# Altium schematic sheet 11_PoE_USB_PD.SchDoc: PoE and USB PD (part 1 of 3)
size A3; Organization: Lime Microsystems; Address1: Surrey Tech Centre; Address2: Guildford GU2 7YG; Address3: Surrey; Address4: United Kingdom; Revision: v1.1; SheetNumber: 11; SheetTotal: 12
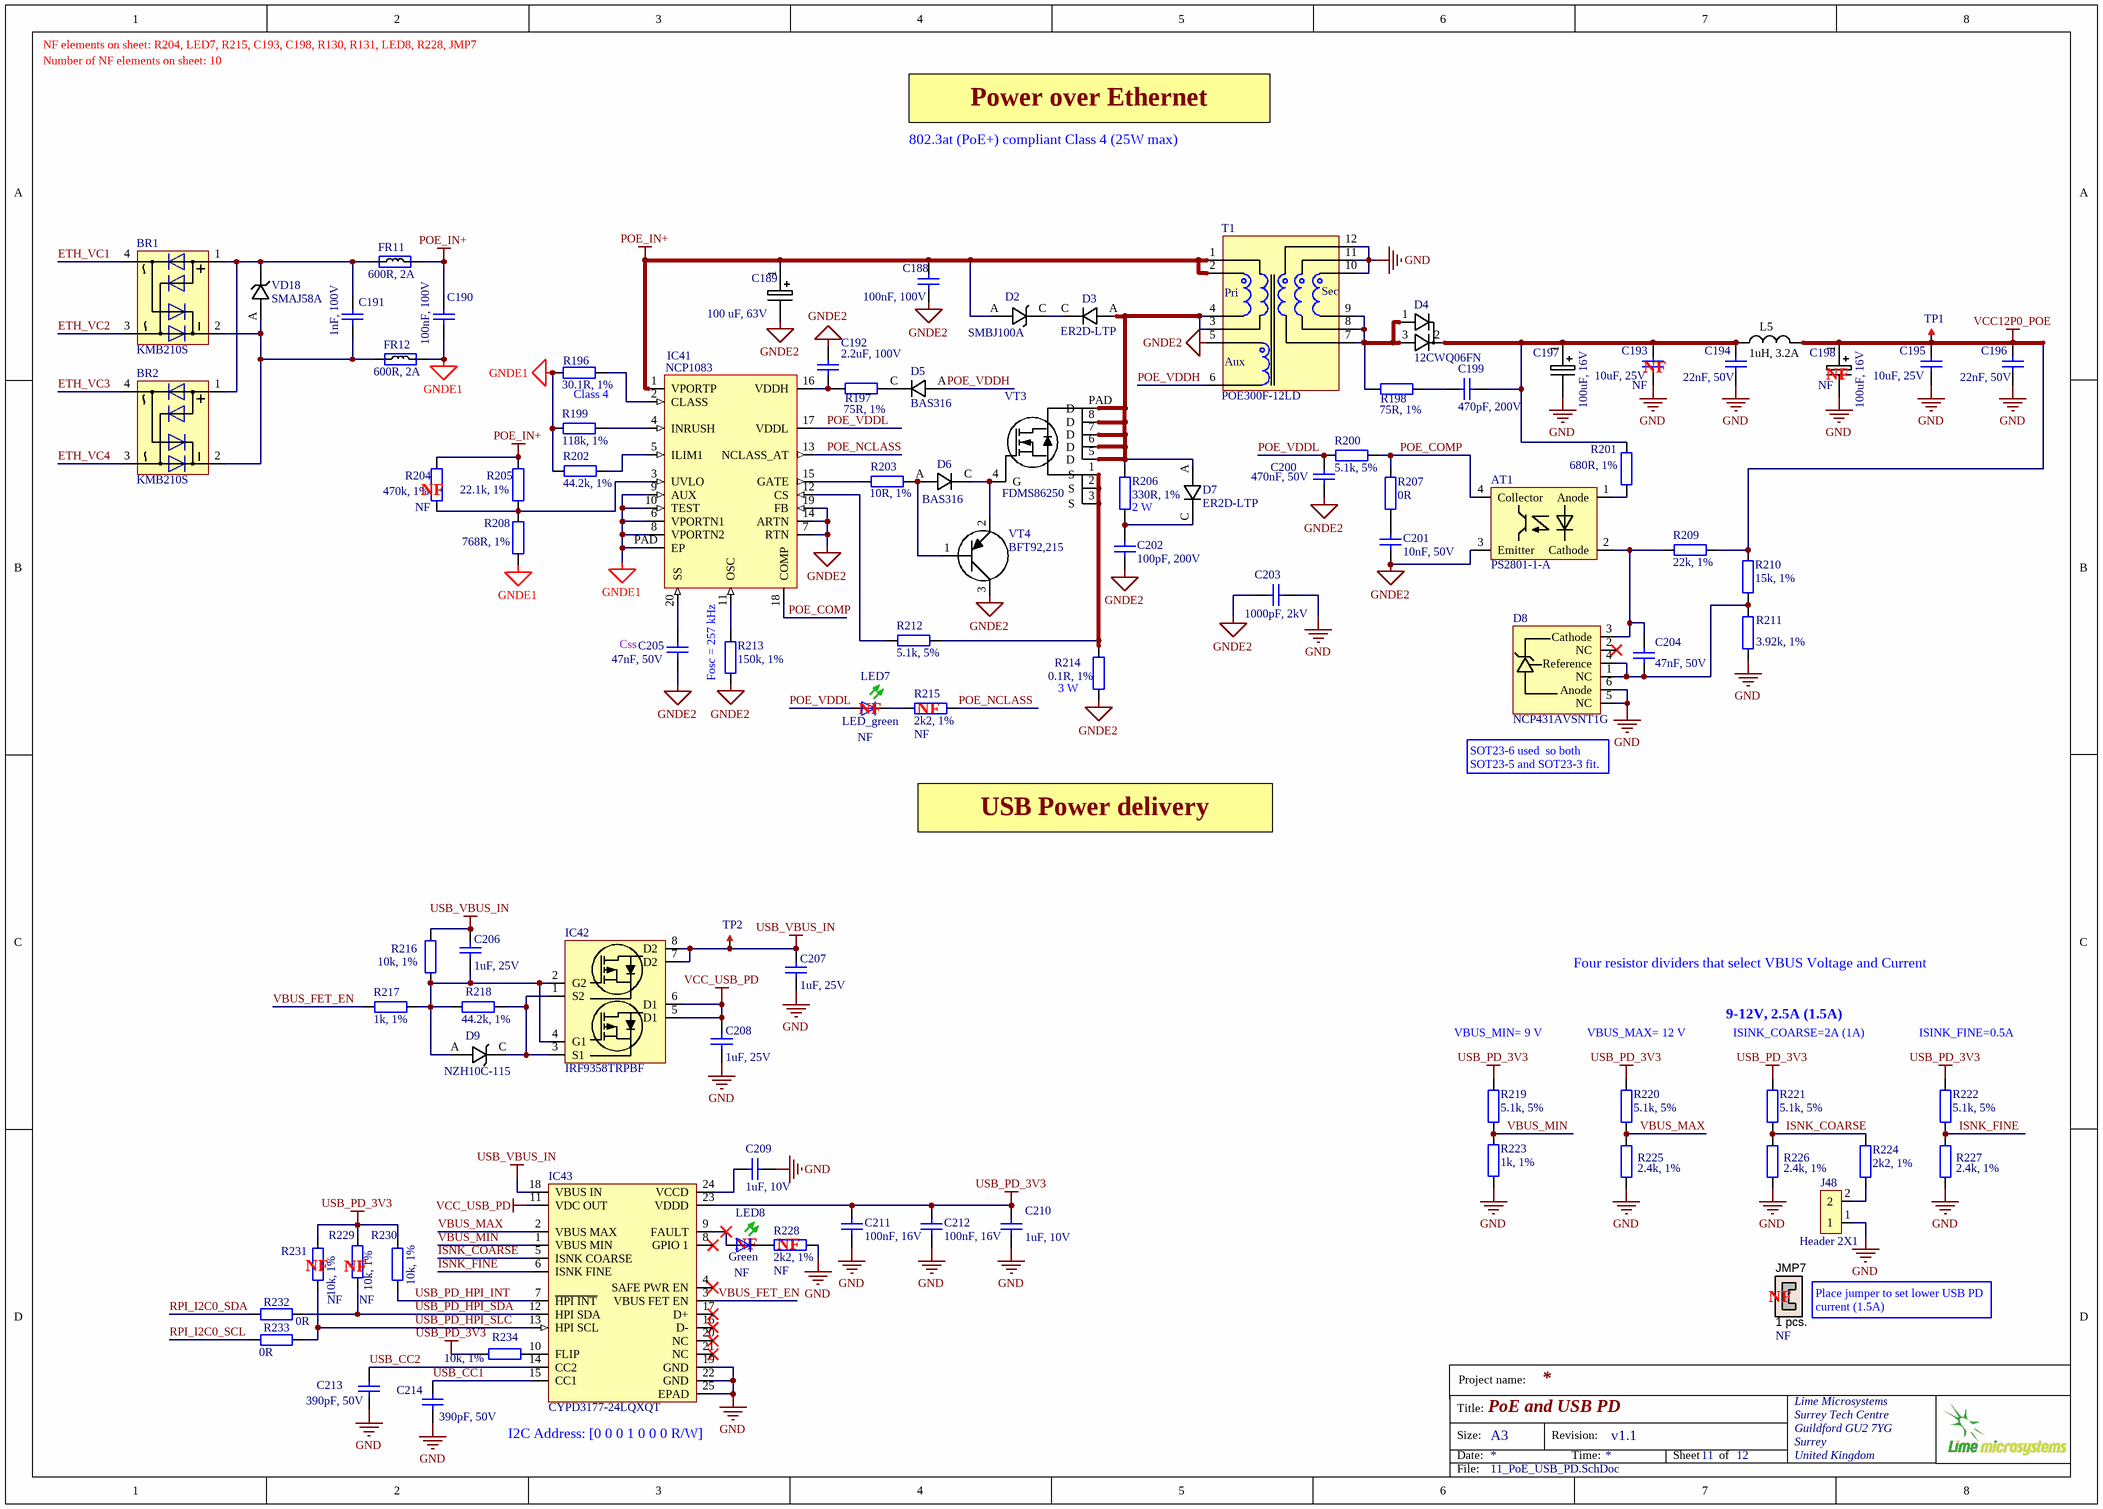
[diagram p0: 11_PoE_USB_PD.SchDoc]

## Parts
AT1  PS2801-1-A  [TCMT1107CT_optoisolator]
BR1  KMB210S  [KMB210S_RECTIFIER_BRIDGE]
BR2  KMB210S  [KMB210S_RECTIFIER_BRIDGE]
C188  100nF, 100V  [CAP0603]
C189  100 uF, 63V  [CAP_POL_D10_H10]
C190  100nF, 100V  [CAP0603]
C191  1nF, 100V  [CAP0603]
C192  2.2uF, 100V  [CAP1206]
C193  10uF, 25V  Assembly Info: NF  [CAP0805]
C194  22nF, 50V  [CAP0402]
C195  10uF, 25V  [CAP0805]
C196  22nF, 50V  [CAP0402]
C197  100uF, 16V  [CAP_POL_SIZE_F_v2]
C198  100uF, 16V  Assembly Info: NF  [CAP_POL_SIZE_F_v2]
C199  470pF, 200V  [CAP0603]
C200  470nF, 50V  [CAP0402]
C201  10nF, 50V  [CAP0402]
C202  100pF, 200V  [CAP0603]
C203  1000pF, 2kV  [CAP1812]
C204  47nF, 50V  [CAP0603]
C205  47nF, 50V  [CAP0603]
C206  1uF, 25V  [CAP0603]
C207  1uF, 25V  [CAP0603]
C208  1uF, 25V  [CAP0603]
C209  1uF, 10V  [CAP0402]
C210  1uF, 10V  [CAP0402]
C211  100nF, 16V  [CAP0402]
C212  100nF, 16V  [CAP0402]
C213  390pF, 50V  [CAP0402]
C214  390pF, 50V  [CAP0402]
D2  SMBJ100A  [SMBJ100A_DIODE_DO-214AA]
D3  ER2D-LTP  [ER2D-LTP_DIODE_DO-214AA]
D4  12CWQ06FN  [12CWQ06FN_diode_array_DPAK]
D5  BAS316  [BAS316_DIODE_SOD323]
D6  BAS316  [BAS316_DIODE_SOD323]
D7  ER2D-LTP  [ER2D-LTP_DIODE_DO-214AA]
D8  NCP431AVSNT1G  [SOT23-6]
D9  NZH10C-115  [NZH10C,115_shottky_diode_SOD123]
FR11  600R, 2A  [RES0805]
FR12  600R, 2A  [RES0805]
IC41  NCP1083  [NCP1083_PoE_controller_TSSOP20]
IC42  IRF9358TRPBF  [IRF9358TRPBF_DUAL_NMOS_SOIC8]
IC43  CYPD3177-24LQXQT  [USB_POWER_DISTR_CYPD3177_QFN24]
J48  Header 2X1  [HDR_1x2]
JMP7  1 pcs.  Assembly Info: NF  (mechanical)
L5  1uH, 3.2A  [NRS4018T3R3MDGJ_inductor]
LED7  LED_green  Assembly Info: NF  [LED-0603-GREEN]
LED8  Green  Assembly Info: NF  [LED-0603-GREEN]
R196  30.1R, 1%  [RES0402]
R197  75R, 1%  [RES0402]
R198  75R, 1%  [RES0402]
R199  118k, 1%  [RES0402]
R200  5.1k, 5%  [RES0402]
R201  680R, 1%  [RES0402]
R202  44.2k, 1%  [RES0402]
R203  10R, 1%  [RES0603]
R204  470k, 1%  Assembly Info: NF  [RES0402]
R205  22.1k, 1%  [RES0402]
R206  330R, 1%  [RES2512]
R207  0R  [RES0402]
R208  768R, 1%  [RES0402]
R209  22k, 1%  [RES0402]
R210  15k, 1%  [RES0402]
R211  3.92k, 1%  [RES0402]
R212  5.1k, 5%  [RES0402]
R213  150k, 1%  [RES0402]
R214  0.1R, 1%  [RES2512]
R215  2k2, 1%  Assembly Info: NF  [RES0402]
R216  10k, 1%  [RES0402]
R217  1k, 1%  [RES0402]
R218  44.2k, 1%  [RES0402]
R219  5.1k, 5%  [RES0402]
R220  5.1k, 5%  [RES0402]
R221  5.1k, 5%  [RES0402]
R222  5.1k, 5%  [RES0402]
R223  1k, 1%  [RES0402]
R224  2k2, 1%  [RES0402]
R225  2.4k, 1%  [RES0402]
R226  2.4k, 1%  [RES0402]
R227  2.4k, 1%  [RES0402]
R228  2k2, 1%  Assembly Info: NF  [RES0402]
R229  10k, 1%  Assembly Info: NF  [RES0402]
R230  10k, 1%  [RES0402]
R231  10k, 1%  Assembly Info: NF  [RES0402]
R232  0R  [RES0402]
R233  0R  [RES0402]
R234  10k, 1%  [RES0402]
T1  POE300F-12LD  [POE300F50LD_TRANSFORMER]
TP1  TESTPOINT_PAD  [TP_PAD_1p5MM]  (value not drawn)  (no BOM)
TP2  TESTPOINT_PAD  [TP_PAD_1p5MM]  (value not drawn)  (no BOM)
VD18  SMAJ58A  [SMAJ58A_shottky_diode]
VT3  FDMS86250  [FDMS86250_NMOS_POWER56]
VT4  BFT92,215  [BFT92,215_PNP_STO23-3]

## Nets
GND: C193.1 C194.2 C195.1 C196.2 C197.2 C198.2 C203.1 C207.1 C208.1 C209.1 C210.1 C211.2 C212.2 C213.2 C214.2 D8.5(NC) D8.6(Anode) IC43.19(GND) IC43.22(GND) IC43.25(EPAD) J48.1 R211.2 R223.2 R225.1 R226.1 R227.1 R228.2 T1.10 T1.11 T1.12
GNDE1: C190.1 FR12.2 IC41.6(VPORTN1) IC41.8(VPORTN2) IC41.9(AUX) IC41.10(TEST) IC41.PAD(EP) R196.1 R199.1 R202.2 R208.2
GNDE2: AT1.3(Emitter) C188.1 C189.2 C192.2 C200.1 C201.1 C202.2 C203.2 C205.1 IC41.7(RTN) IC41.14(ARTN) IC41.19(FB) R213.1 R214.1 T1.5 VT4.3(C)
POE_IN+: C188.2 C189.1 C190.2 D2.A FR11.2 IC41.1(VPORTP) R204.2 R205.2 T1.1 T1.2
USB_PD_3V3: C210.2 C211.1 C212.1 IC43.23(VDDD) R219.1 R220.1 R221.1 R222.1 R229.2 R230.2 R231.2 R234.1
USB_VBUS_IN: C206.2 C207.2 IC42.7(D2) IC42.8(D2) IC43.18(VBUS_IN) R216.2 TP2.1
VCC12P0_POE: C195.2 C196.1 C198.1 L5.2 R209.1 R210.1 TP1.1
VCC_USB_PD: C208.2 IC42.5(D1) IC42.6(D1) IC43.11(VDC_OUT)
ETH_VC1: BR1.4
ETH_VC2: BR1.3
ETH_VC3: BR2.4
ETH_VC4: BR2.3
ISNK_COARSE: IC43.5(ISNK_COARSE) R221.2 R224.2 R226.2
ISNK_FINE: IC43.6(ISNK_FINE) R222.2 R227.2
POE_COMP: AT1.4(Collector) IC41.18(COMP) R200.1 R207.1
POE_NCLASS: IC41.13(NCLASS_AT) R215.2
POE_VDDH: D5.A T1.6
POE_VDDL: C200.2 IC41.17(VDDL) LED7.A R200.2
RPI_I2C0_SCL: R233.2
RPI_I2C0_SDA: R232.2
USB_CC1: C214.1 IC43.15(CC1)
USB_CC2: C213.1 IC43.14(CC2)
USB_PD_HPI_INT: IC43.7(~{HPI_INT}) R230.1
USB_PD_HPI_SDA: IC43.12(HPI_SDA) R229.1 R232.1
USB_PD_HPI_SLC: IC43.13(HPI_SCL) R231.1 R233.1
VBUS_FET_EN: IC43.3(VBUS_FET_EN) R217.2
VBUS_MAX: IC43.2(VBUS_MAX) R220.2 R225.2
VBUS_MIN: IC43.1(VBUS_MIN) R219.2 R223.1
NetAT1_1: AT1.1(Anode) R201.2
NetAT1_2: AT1.2(Cathode) C204.2 D8.3(Cathode) R209.2
NetBR1_1: BR1.1 BR2.1 C191.1 FR11.1 VD18.K
NetBR1_2: BR1.2 BR2.2 C191.2 FR12.1 VD18.A
NetC192_1: C192.1 IC41.16(VDDH) R197.1
NetC193_2: C193.2 C194.1 C197.1 C199.2 D4.2 L5.1 R201.1
NetC199_1: C199.1 R198.2
NetC201_2: C201.2 R207.2
NetC202_1: C202.1 D7.C R206.1
NetC204_1: C204.1 D8.1(NC) D8.4(Reference) R210.2 R211.1
NetC205_2: C205.2 IC41.20(SS)
NetC206_1: C206.1 D9.A IC42.2(G2) IC42.4(G1) R216.1 R217.1 R218.2
NetC209_2: C209.2 IC43.24(VCCD)
NetD2_C: D2.C D3.C
NetD3_A: D3.A D7.A R206.2 T1.3 T1.4 VT3.5(D) VT3.6(D) VT3.7(D) VT3.8(D) VT3.PAD(D)
NetD4_1: D4.1 D4.3 R198.1 T1.7 T1.8 T1.9
NetD5_C: D5.C R197.2
NetD6_A: D6.A R203.1 VT4.1(S)
NetD6_C: D6.C VT3.4(G) VT4.2(E)
NetD9_C: D9.C IC42.1(S2) IC42.3(S1) R218.1
NetIC41_2: IC41.2(CLASS) R196.2
NetIC41_3: IC41.3(UVLO) R204.1 R205.1 R208.1
NetIC41_4: IC41.4(INRUSH) R199.2
NetIC41_5: IC41.5(ILIM1) R202.1
NetIC41_11: IC41.11(OSC) R213.2
NetIC41_12: IC41.12(CS) R212.2
NetIC41_15: IC41.15(GATE) R203.2
NetIC43_9: IC43.9(FAULT) LED8.A
NetIC43_10: IC43.10(FLIP) R234.2
NetJ48_2: J48.2 R224.1
NetLED7_K: LED7.K(C) R215.1
NetLED8_K: LED8.K(C) R228.1
NetR212_1: R212.1 R214.2 VT3.1(S) VT3.2(S) VT3.3(S)

Not connected (* = marked no-connect by the designer): D8 2(NC)*; IC43 4(SAFE_PWR_EN)* 8(GPIO_1)* 16(D-)* 17(D+)* 20(NC)* 21(NC)*; JMP7 1 2

## Notes on the sheet
- NF elements on sheet: R204, LED7, R215, C193, C198, R130, R131, LED8, R228, JMP7
- Number of NF elements on sheet: 10
- 802.3at (PoE+) compliant Class 4 (25W max)
- Power over Ethernet
- (near C193) NF
- (near C198) NF
- Class 4
- (near R204) NF
- (near R206) 2 W
- Css
- Fosc = 257 kHz
- (near LED7) NF
- (near R215) NF
- (near R214) 3 W
- (near D8) SOT23-6 used  so both SOT23-5 and SOT23-3 fit.
- USB Power delivery
- Four resistor dividers that select VBUS Voltage and Current
- (near R219) VBUS_MIN= 9 V
- (near R220) VBUS_MAX= 12 V
- 9-12V, 2.5A (1.5A)
- (near R221) ISINK_COARSE=2A (1A)
- (near R222) ISINK_FINE=0.5A
- NF
- (near R228) NF
- (near R231) NF
- (near R229) NF
- (near JMP7) NF
- Place jumper to set lower USB PD current (1.5A)
- (near IC43) I2C Address: [0 0 0 1 0 0 0 R/W]
- Project name:
- Title:
- Size:
- Date:
- A3
- Revision:
- Time:
- Sheet
- of
- File:
- (in symbol POE300F-50LD_transformer) Pri; Sec; Aux